# Altium schematic sheet PDM-S06-V00-CAN.SchDoc: CAN Bus
size A3; DrawnBy: Jonn Dillon; Organization: QUT Motorsport; Address1: O-120, Gardens Point; Address2: 2 George Street; Address3: Brisbane, QLD 4000; Address4: Australia; DocumentNumber: 6; Revision: 01; SheetNumber: 6; SheetTotal: 9; Version: 01; Project: Power Distribution Module; PageSetup: Record=PageOptions|CenterHorizontal=True|CenterVertical=True|PrintScale=0.97|XCorrection=1.00|YCorrection=1.00|PrintKind=0|BorderSize=5000000|LeftOffset=0|BottomOffset=0|Orientation=2|PaperLength=1000|PaperWidth=1000|Scale=100|PaperSource=7|PrintQuality=-4|MediaType=1|DitherType=10|PaperKind=A4|PrintScaleMode=1
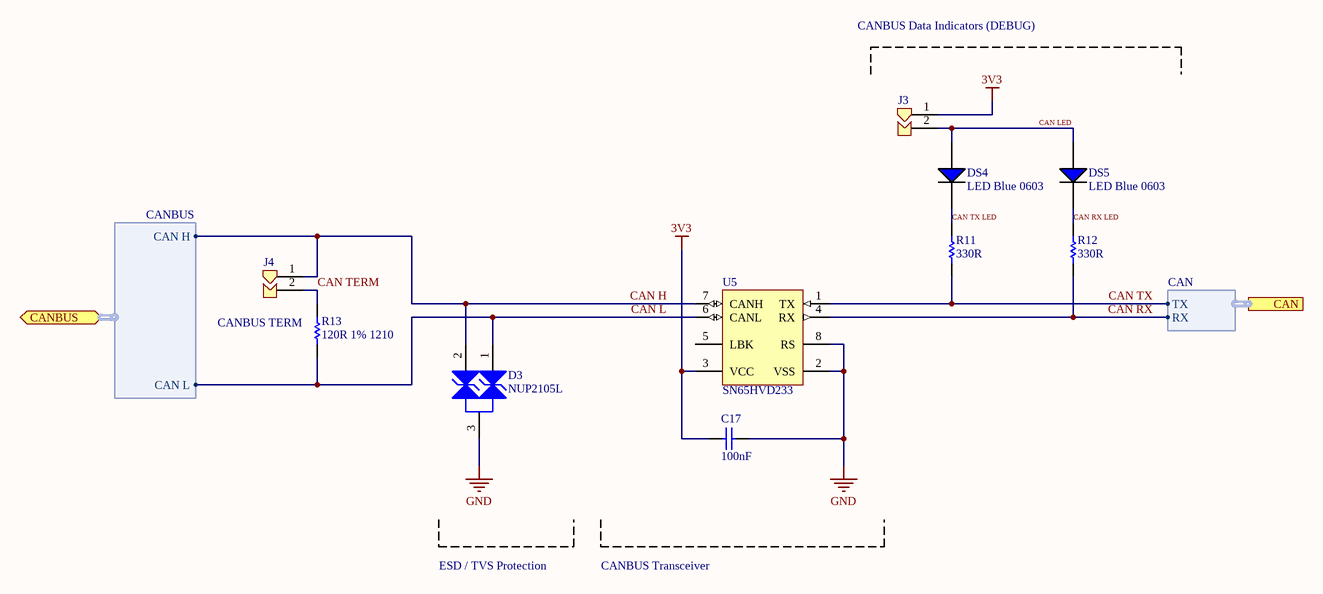
[diagram p0: PDM-S06-V00-CAN.SchDoc]

## Parts
C17  100nF  [Cap_Ceramic_0603]
D3  NUP2105L  [NUP2105L]
DS4  LED Blue 0603  [LED BLUE 0603]
DS5  LED Blue 0603  [LED BLUE 0603]
J3  Jumper 2Way Solderable  [Jumper_2Way_Solderable]  (value not drawn)
J4  Jumper 2Way Solderable  [Jumper_2Way_Solderable]  (value not drawn)
R11  330R  [Res_ThinFilm_0603]
R12  330R  [Res_ThinFilm_0603]
R13  120R 1% 1210  [Res_ThinFilm_1210]
U5  SN65HVD233  [SN65HVD233DR]

## Ports
CAN (harness CAN), CANBUS (bidir, harness CANBUS)

## Harnesses
CANBUS: CAN H, CAN L
CAN: RX, TX

## Nets
3V3: C17.2 J3.1 U5.3(VCC)
GND: C17.1 D3.3 U5.2(VSS) U5.8(RS)
CAN H: D3.2 J4.1 U5.7(CANH) ; port CANBUS.CAN H
CAN L: D3.1 R13.1 U5.6(CANL) ; port CANBUS.CAN L
CAN LED: DS4.1(A) DS5.1(A) J3.2
CAN RX: R12.1 U5.4(RX) ; port CAN.RX
CAN RX LED: DS5.2(C) R12.2
CAN TERM: J4.2 R13.2
CAN TX: R11.1 U5.1(TX) ; port CAN.TX
CAN TX LED: DS4.2(C) R11.2

Not connected (* = marked no-connect by the designer): U5 5(LBK)

## Notes on the sheet
- CANBUS Data Indicators (DEBUG)
- (near R13) CANBUS TERM
- ESD / TVS Protection
- CANBUS Transceiver
- Revision History:
- Sheet Title:
- Rev
- Date
- Description
- Project:
- Size:
- Drawn By:
- A3
- Number:
- Revision:
- Sheet
- Version:
- of
- QUT Motorsport
- O-120, Gardens Point
- 2 George Street
- Brisbane, QLD 4000
- Australia
- Print Date:
- Print Time:
- File Name:

## Library data of the parts
C17 = 100nF 50V 5% X7R 0603: Capacitor, Ceramic, SMD, 100nF, 50V, 5%, X7R, 0603
J3 J4 = Jumper 2Way Side Solderable
R11 R12 = 330R 5% 0603: Resistor, SMD, 330R, 0.1W, 5%, 0603
R13 = 120R 1% 1210: Resistor, SMD, 120R, 0.25W, 1%, 1210
D3 = NUP2105L: ComponentLink1Description: Datasheet; ComponentLink1URL: https://www.onsemi.cn/PowerSolutions/document/NUP2105L-D.PDF; Parameter 1: *; ComponentLink2Description: LCSC; ComponentLink2URL: https://lcsc.com/product-detail/TVS_ON-Semiconductor-NUP2105LT1G_C14486.html; ComponentLink3Description: Digikey; ComponentLink3URL: https://www.digikey.com.au/product-detail/en/on-semiconductor/SZNUP2105LT1G/SZNUP2105LT1GOSCT-ND/3487669
U5 = SN65HVD233: ComponentLink1Description: LCSC; ComponentLink1URL: https://lcsc.com/product-detail/CAN-ICs_Texas-Instruments_SN65HVD233DRG4_Texas-Instruments-Texas-Instruments-SN65HVD233DRG4_C61643.html; ComponentLink2Description: Digikey; ComponentLink2URL: https://www.digikey.com.au/product-detail/en/texas-instruments/SN65HVD233DR/296-35967-1-ND/4134960; ComponentLink3Description: Datasheet; ComponentLink3URL: https://www.ti.com/lit/ds/symlink/sn65hvd233.pdf?ts=1588560888178; ComponentLink4Description: Ti Product Page; ComponentLink4URL: https://www.ti.com/product/SN65HVD233